# Altium schematic sheet Spinning_3D_Cube.SchDoc
size A; DocumentNumber: 1; SheetNumber: 1; SheetTotal: 1; PageSetup: Record=PageOptions|CenterHorizontal=True|CenterVertical=True|PrintScale=0.71|XCorrection=1.00|YCorrection=1.00|PrintKind=1|BorderSize=5000000|LeftOffset=0|BottomOffset=0|Orientation=2|PaperLength=1000|PaperWidth=1000|Scale=100|PaperSource=7|PrintQuality=-4|MediaType=1|DitherType=10|PaperKind=A3 (297 x 420 mm)|PrintScaleMode=1
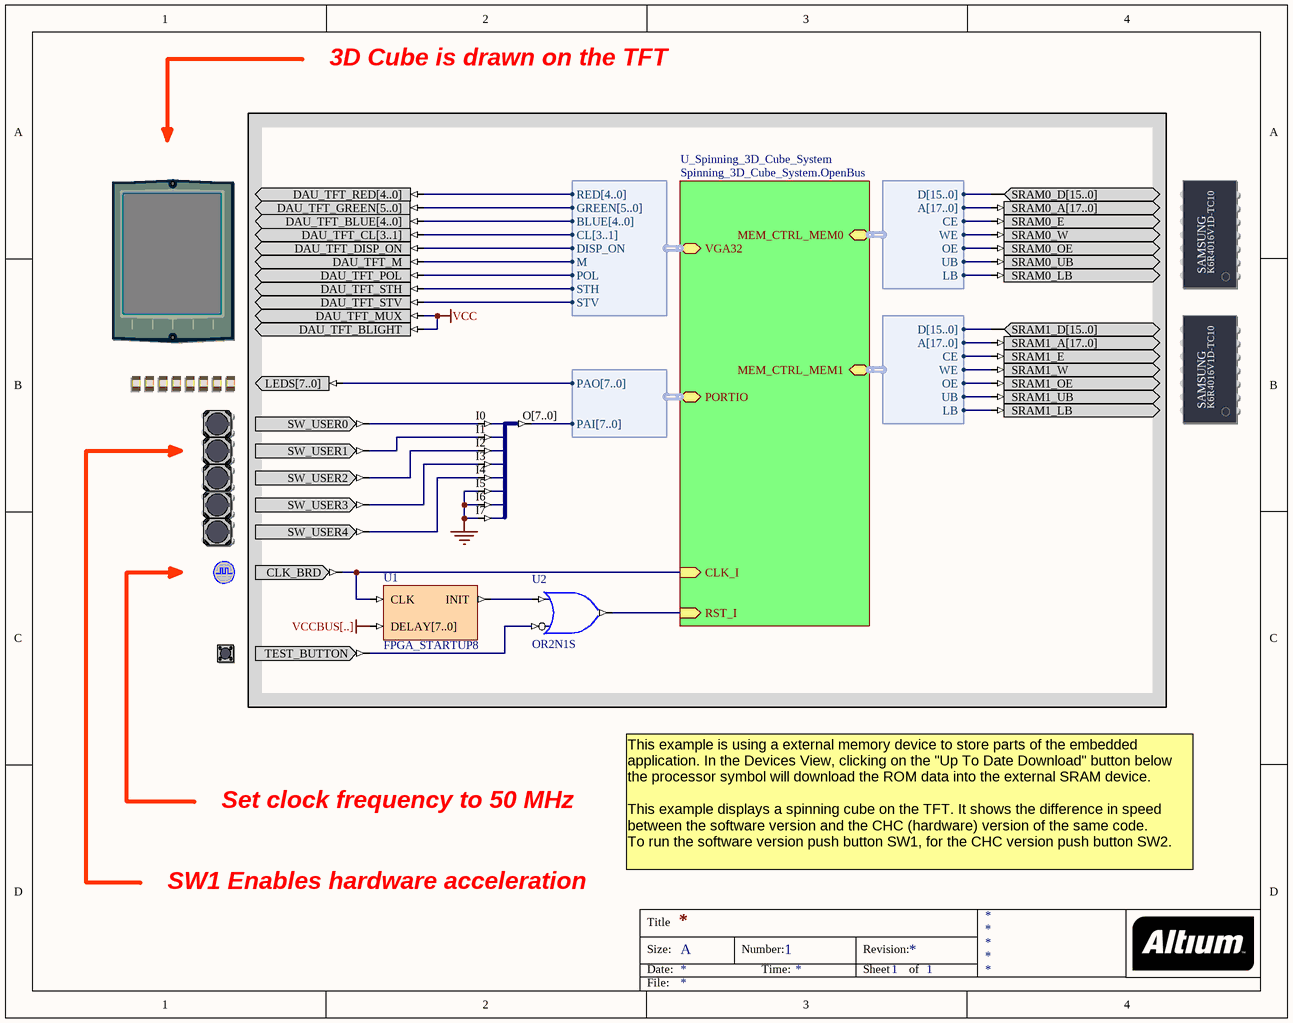
[diagram p0: Spinning_3D_Cube.SchDoc]

## Parts
(Parts that share a designator on the sheet are numbered #1, #2 ... from top to bottom, then left to right.)
?#1  TFT_LCD  (value not drawn)
?#2  SRAM_DAUGHTER0  (value not drawn)
?#3  SRAM_DAUGHTER1  (value not drawn)
?#4  LED  (value not drawn)
?#5  USER_BUTTON0  (value not drawn)
?#6  USER_BUTTON1  (value not drawn)
?#7  USER_BUTTON2  (value not drawn)
?#8  USER_BUTTON3  (value not drawn)
?#9  USER_BUTTON4  (value not drawn)
?#10  CLOCK_BOARD  (value not drawn)
?#11  TEST_BUTTON  (value not drawn)
U1  FPGA_STARTUP8
U2  OR2N1S
U10  J8S_8B  (value not drawn)

## Sub-sheets
U_Spinning_3D_Cube_System = Spinning_3D_Cube_System.OpenBus: RST_I (in), CLK_I (in), MEM_CTRL_MEM0 (harness WB_MEM_CTRL_SRAM16_A18), MEM_CTRL_MEM1 (harness WB_MEM_CTRL_SRAM16_A18), VGA32 (harness VGA32_TFT), PORTIO (harness WB_PRTIO_IO_1_1)

## Harnesses
VGA32_TFT: RED[4..0], GREEN[5..0], BLUE[4..0], CL[3..1], DISP_ON, M, POL, STH, STV
WB_PRTIO_IO_1_1: PAO[7..0], PAI[7..0]
WB_MEM_CTRL_SRAM16_A18: D[15..0], A[17..0], CE, WE, OE, UB, LB

## Nets
GND: U10.I5 U10.I6 U10.I7
VCC: ?#1.DAU_TFT_BLIGHT ?#1.DAU_TFT_MUX
VCCBUS[..]: U1.DELAY[7..0]
Net?#1_DAU_TFT_BLUE[4..0]: ?#1.DAU_TFT_BLUE[4..0] ; sheet U_Spinning_3D_Cube_System/VGA32.BLUE[4..0]
Net?#1_DAU_TFT_CL[3..1]: ?#1.DAU_TFT_CL[3..1] ; sheet U_Spinning_3D_Cube_System/VGA32.CL[3..1]
Net?#1_DAU_TFT_DISP_ON: ?#1.DAU_TFT_DISP_ON ; sheet U_Spinning_3D_Cube_System/VGA32.DISP_ON
Net?#1_DAU_TFT_GREEN[5..0]: ?#1.DAU_TFT_GREEN[5..0] ; sheet U_Spinning_3D_Cube_System/VGA32.GREEN[5..0]
Net?#1_DAU_TFT_M: ?#1.DAU_TFT_M ; sheet U_Spinning_3D_Cube_System/VGA32.M
Net?#1_DAU_TFT_POL: ?#1.DAU_TFT_POL ; sheet U_Spinning_3D_Cube_System/VGA32.POL
Net?#1_DAU_TFT_RED[4..0]: ?#1.DAU_TFT_RED[4..0] ; sheet U_Spinning_3D_Cube_System/VGA32.RED[4..0]
Net?#1_DAU_TFT_STH: ?#1.DAU_TFT_STH ; sheet U_Spinning_3D_Cube_System/VGA32.STH
Net?#1_DAU_TFT_STV: ?#1.DAU_TFT_STV ; sheet U_Spinning_3D_Cube_System/VGA32.STV
Net?#2_SRAM0_A[17..0]: ?#2.SRAM0_A[17..0] ; sheet U_Spinning_3D_Cube_System/MEM_CTRL_MEM0.A[17..0]
Net?#2_SRAM0_D[15..0]: ?#2.SRAM0_D[15..0] ; sheet U_Spinning_3D_Cube_System/MEM_CTRL_MEM0.D[15..0]
Net?#2_SRAM0_E: ?#2.SRAM0_E ; sheet U_Spinning_3D_Cube_System/MEM_CTRL_MEM0.CE
Net?#2_SRAM0_LB: ?#2.SRAM0_LB ; sheet U_Spinning_3D_Cube_System/MEM_CTRL_MEM0.LB
Net?#2_SRAM0_OE: ?#2.SRAM0_OE ; sheet U_Spinning_3D_Cube_System/MEM_CTRL_MEM0.OE
Net?#2_SRAM0_UB: ?#2.SRAM0_UB ; sheet U_Spinning_3D_Cube_System/MEM_CTRL_MEM0.UB
Net?#2_SRAM0_W: ?#2.SRAM0_W ; sheet U_Spinning_3D_Cube_System/MEM_CTRL_MEM0.WE
Net?#3_SRAM1_A[17..0]: ?#3.SRAM1_A[17..0] ; sheet U_Spinning_3D_Cube_System/MEM_CTRL_MEM1.A[17..0]
Net?#3_SRAM1_D[15..0]: ?#3.SRAM1_D[15..0] ; sheet U_Spinning_3D_Cube_System/MEM_CTRL_MEM1.D[15..0]
Net?#3_SRAM1_E: ?#3.SRAM1_E ; sheet U_Spinning_3D_Cube_System/MEM_CTRL_MEM1.CE
Net?#3_SRAM1_LB: ?#3.SRAM1_LB ; sheet U_Spinning_3D_Cube_System/MEM_CTRL_MEM1.LB
Net?#3_SRAM1_OE: ?#3.SRAM1_OE ; sheet U_Spinning_3D_Cube_System/MEM_CTRL_MEM1.OE
Net?#3_SRAM1_UB: ?#3.SRAM1_UB ; sheet U_Spinning_3D_Cube_System/MEM_CTRL_MEM1.UB
Net?#3_SRAM1_W: ?#3.SRAM1_W ; sheet U_Spinning_3D_Cube_System/MEM_CTRL_MEM1.WE
Net?#4_LEDS[7..0]: ?#4.LEDS[7..0] ; sheet U_Spinning_3D_Cube_System/PORTIO.PAO[7..0]
Net?#5_SW_USER0: ?#5.SW_USER0 U10.I0
Net?#6_SW_USER1: ?#6.SW_USER1 U10.I1
Net?#7_SW_USER2: ?#7.SW_USER2 U10.I2
Net?#8_SW_USER3: ?#8.SW_USER3 U10.I3
Net?#9_SW_USER4: ?#9.SW_USER4 U10.I4
Net?#10_CLK_BRD: ?#10.CLK_BRD U1.CLK ; sheet U_Spinning_3D_Cube_System/CLK_I
Net?#11_TEST_BUTTON: ?#11.TEST_BUTTON U2.I0
NetU1_INIT: U1.INIT U2.I1
NetU2_O: U2.O ; sheet U_Spinning_3D_Cube_System/RST_I
NetU10_O[7..0]: U10.O[7..0] ; sheet U_Spinning_3D_Cube_System/PORTIO.PAI[7..0]

## Notes on the sheet
- 3D Cube is drawn on the TFT
- Set clock frequency to 50 MHz
- SW1 Enables hardware acceleration
- This example is using a external memory device to store parts of the embedded application. In the Devices View, clicking on the "Up To Date Download" button below the processor symbol will download the ROM data into the external SRAM device.
  This example displays a spinning cube on the TFT. It shows the difference in speed between the software version and the CHC (hardware) version of the same code.
  To run the software version push button SW1, for the CHC version push button SW2.
- Title
- Size:
- Date:
- A
- Number:
- Time:
- Revision:
- Sheet
- of
- File:
- (in symbol SRAM_DAUGHTER0) SAMSUNG; K6R4016V1D-TC10
- (in symbol SRAM_DAUGHTER1) SAMSUNG; K6R4016V1D-TC10

## Library data of the parts
?#1 = TFT_LCD: TFT LCD Panel; PortComponent: True; Published: 22-Jan-2007; Publisher: Altium Limited; HelpURL: TR0143 Technical Reference Manual for Altium's Desktop NanoBoard NB2DSK01.pdf#page=50
?#2 = SRAM_DAUGHTER0: Free Static RAM - Daughterboard; PortComponent: True; Published: 14-May-2007; Publisher: Altium Limited; HelpURL: TR0143 NanoBoard Technical Reference Manual - NB2.pdf#page=24
?#3 = SRAM_DAUGHTER1: Free Static RAM - Daughterboard; PortComponent: True; Published: 14-May-2007; Publisher: Altium Limited; HelpURL: TR0143 NanoBoard Technical Reference Manual - NB2.pdf#page=24
?#4 = LED: Bank of eight Red LEDs; PortComponent: True; Published: 19-Nov-2003; Publisher: Altium Limited; HelpURL: TR0143 NanoBoard Technical Reference Manual - NB2.pdf#page=45
?#5 = USER_BUTTON0: Generic User Button; PortComponent: True; Published: 16-Apr-2007; Publisher: Altium Limited; HelpURL: TR0143 NanoBoard Technical Reference Manual - NB2.pdf#page=47
?#6 = USER_BUTTON1: Generic User Button; PortComponent: True; Published: 16-Apr-2007; Publisher: Altium Limited; HelpURL: TR0143 NanoBoard Technical Reference Manual - NB2.pdf#page=47
?#7 = USER_BUTTON2: Generic User Button; PortComponent: True; Published: 16-Apr-2007; Publisher: Altium Limited; HelpURL: TR0143 NanoBoard Technical Reference Manual - NB2.pdf#page=47
?#8 = USER_BUTTON3: Generic User Button; PortComponent: True; Published: 16-Apr-2007; Publisher: Altium Limited; HelpURL: TR0143 NanoBoard Technical Reference Manual - NB2.pdf#page=47
?#9 = USER_BUTTON4: Generic User Button; PortComponent: True; Published: 16-Apr-2007; Publisher: Altium Limited; HelpURL: TR0143 NanoBoard Technical Reference Manual - NB2.pdf#page=47
?#10 = CLOCK_BOARD: Global System Clock Supply; PortComponent: True; Published: 19-Nov-2003; Publisher: Altium Limited; HelpURL: TR0143 Technical Reference Manual for Altium's Desktop NanoBoard NB2DSK01.pdf#page=41; UseInDSF: True
?#11 = TEST_BUTTON: Test / Reset Button; PortComponent: True; Published: 19-Nov-2003; Publisher: Altium Limited; HelpURL: TR0143 Technical Reference Manual for Altium's Desktop NanoBoard NB2DSK01.pdf#page=53
U1 = FPGA_STARTUP8: FPGA Startup With 8 Bit Delay; Published: 9-Dec-2004; Publisher: Altium Limited; HelpURL: CR0119 FPGA_STARTUPx Powerup Delay Unit.pdf; LastRevisionNo: 1.00.00; ComponentLink1Description: Core &Resource Usage; ComponentLink1URL: CR0139 FPGA Peripheral Resource Usage.pdf#page=11
U2 = OR2N1S: 2-Input OR Gate with Active Low A Input, Single Pin Version; XilinxEquivalent: OR2B1; FunctionalClass: Logic Primitive; PortSize: 2; ArchiveName: GENERIC; VHDLIB_SIM: GENERIC_LIB; Published: 29-Jan-2004; Publisher: Altium Limited; LastRevisionNo: 1.00.00; HelpURL: CR0118 FPGA Generic Library Guide.pdf#page=410; ComponentLink1URL: CR0136 FPGA Logic Primitive Resource Usage.pdf#page=187; ComponentLink1Description: Core &Resource Usage; SubClass: OR; PortStyle: Single Pin Version
U10 = J8S_8B: 8 Single pin inputs to single 8-Bit output bus; FunctionalClass: Bus Joiner; PortSize: 8; ArchiveName: GENERIC; VHDLIB_SIM: GENERIC_LIB; Published: 29-Jan-2004; Publisher: Altium Limited; LastRevisionNo: 1.00.00; HelpURL: CR0118 FPGA Generic Library Guide.pdf#page=306; ComponentLink1URL: CR0126 FPGA Bus Joiner Resource Usage.pdf#page=28; ComponentLink1Description: Core &Resource Usage